# EAGLE design BurnBabyBurn (EAGLE 6.5.0)
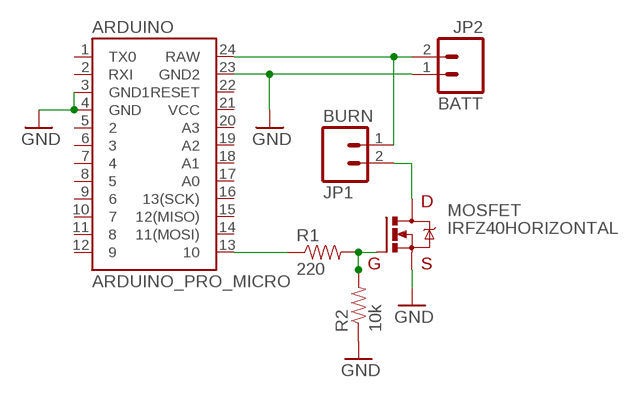
[diagram p0: schematic, sheet 1]

## Parts
ARDUINO  ARDUINO_PRO_MICRO  [ARDUINO_PRO_MICRO]
JP1  BURN  M023.5MM  [SCREWTERMINAL-3.5MM-2]
JP2  BATT  M023.5MM  [SCREWTERMINAL-3.5MM-2]
MOSFET  IRFZ40HORIZONTAL  [TO220]
R1  220  RESISTOREZ  [AXIAL-0.3EZ]
R2  10k  RESISTOREZ  [AXIAL-0.3EZ]

## Nets
GND: ARDUINO.3(GND1) ARDUINO.4(GND) ARDUINO.23(GND2) JP2.1 MOSFET.3(S) R2.P$1
N$1: MOSFET.1(G) R1.P$2 R2.P$2
N$2: JP1.2 MOSFET.2(D)
N$3: ARDUINO.13 R1.P$1
VBATT: ARDUINO.24(RAW) JP1.1 JP2.2
Unconnected: ARDUINO.1(TX0) ARDUINO.2(RXI) ARDUINO.5 ARDUINO.6 ARDUINO.7 ARDUINO.8 ARDUINO.9 ARDUINO.10 ARDUINO.11 ARDUINO.12 ARDUINO.14(11(MOSI)) ARDUINO.15(12(MISO)) ARDUINO.16(13(SCK)) ARDUINO.17(A0) ARDUINO.18(A1) ARDUINO.19(A2) ARDUINO.20(A3) ARDUINO.21(VCC) ARDUINO.22(RESET)

## Library data of the parts
ARDUINO = SparkFun-Boards:ARDUINO_PRO_MICRO
JP1 JP2 = SparkFun:M02: Header 2 Standard 2-pin 0.1" header. Use with straight break away headers (SKU : PRT-00116), right angle break away headers (PRT-00553), swiss pins (PRT-00743), machine pins (PRT-00117), and female headers (PRT-00115). Molex polarized connector foot print use with SKU : PRT-08233 with associated crimp pins and housings.
MOSFET = Johnboiles:IRFZ40: MOSFET: N-Channel; Vds 60V; Rds (Vgs=10V) .028; Id 50A (Vgs=10V)
R1 R2 = SparkFun-Resistors:RESISTOR: Resistor Basic schematic elements and footprints for 0603, 1206, and PTH resistors.

## Board
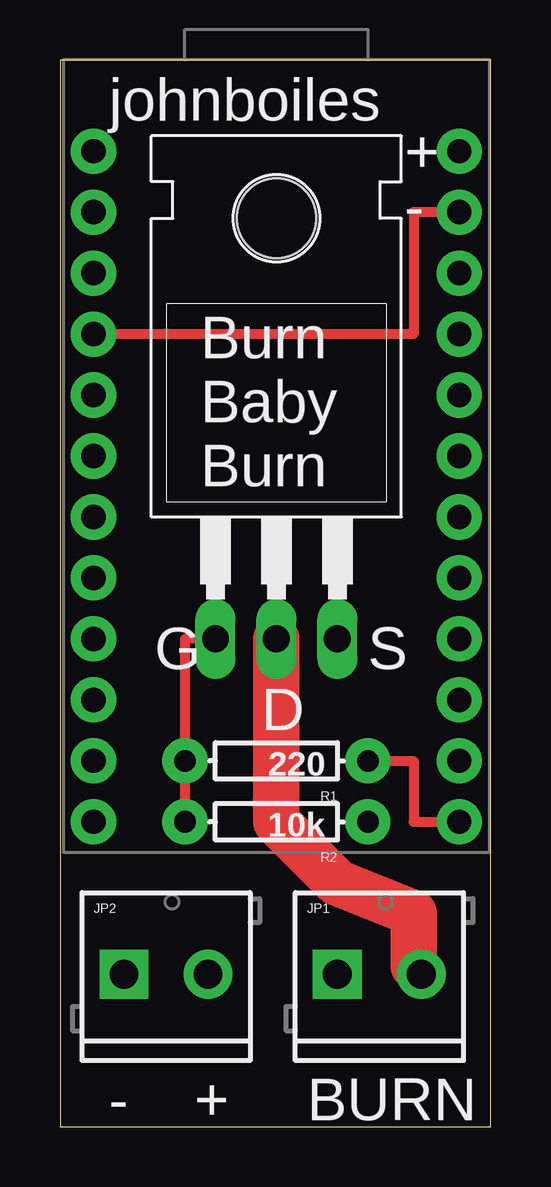
[diagram p1: board, top side]
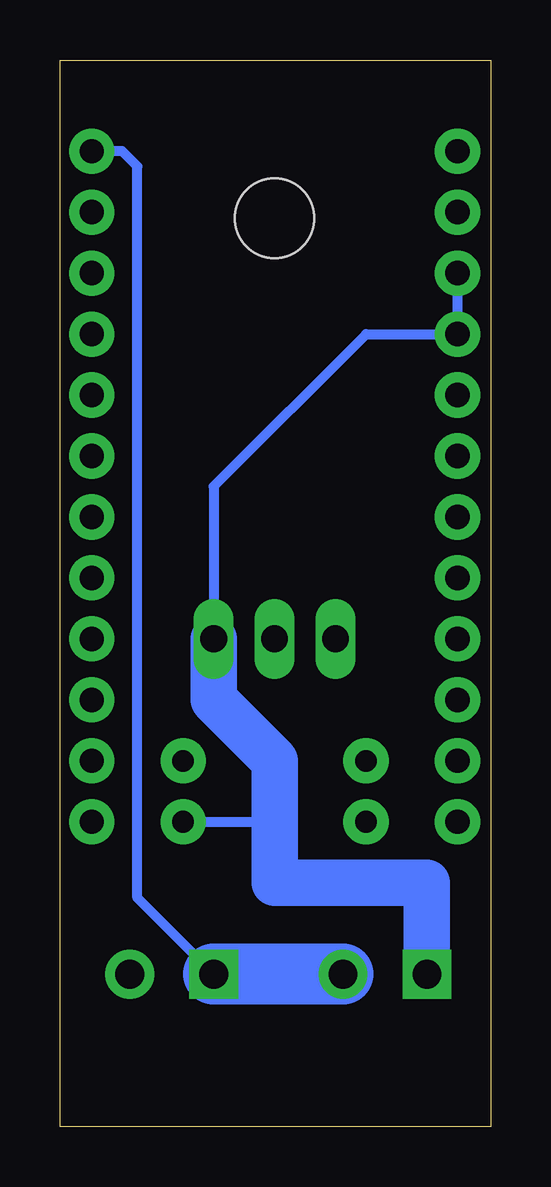
[diagram p2: board, bottom side, seen from below]

Size 17.96 x 44.44 mm. Coordinates in mm from the lower left corner, seen from the top.
Outline: 0,0 17.96,0 17.96,44.44 0,44.44 0,0
Copper layers (1*16): Top 0.0356mm / dielectric 1.5011mm / Bottom 0.0356mm
Design rules "LaenPCBOrder": minimum track width 6mil, minimum drill 13mil, track to track 6mil, track to pad 6mil, pad to pad 6mil, via to via 6mil, smd to smd 6mil, copper to edge 15mil, drill to drill 6mil, minimum pad ring 7mil, minimum via ring 7mil, stop-mask expansion 4mil, vias tented up to drill 0mil, thermal gap 10mil

### Footprints (pad centres in the part's own frame; a part is rotated, then mirrored left to right if it is on the bottom)
ARDUINO_PRO_MICRO = drill 1.016 pad 1.88: 1 -7.62,12.7; 2 -7.62,10.16; 3 -7.62,7.62; 4 -7.62,5.08; 5 -7.62,2.54; 6 -7.62,0; 7 -7.62,-2.54; 8 -7.62,-5.08; 9 -7.62,-7.62; 10 -7.62,-10.16; 11 -7.62,-12.7; 12 -7.62,-15.24; 13 7.62,-15.24; 14 7.62,-12.7; 15 7.62,-10.16; 16 7.62,-7.62; 17 7.62,-5.08; 18 7.62,-2.54; 19 7.62,0; 20 7.62,2.54; 21 7.62,5.08; 22 7.62,7.62; 23 7.62,10.16; 24 7.62,12.7
SCREWTERMINAL-3.5MM-2 = drill 1.2 pad 2.032 square: 1 0,0 | drill 1.2 pad 2.032: 2 3.5,0
TO220 = drill 1.118 long: 1 -2.54,-6.35; 2 0,-6.35; 3 2.54,-6.35 | hole 3.302: 0,11.176
AXIAL-0.3EZ = drill 0.9 pad 1.88: P$1 -3.81,0; P$2 3.81,0

### Placement (x,y rotation side)
ARDUINO  9.02,27.94 0 top
JP1  11.56,6.35 0 top
JP2  2.67,6.35 0 top
MOSFET  9.02,26.67 0 top
R1  9.02,15.24 180 top
R2  9.02,12.7 180 top

### Tracks (layer width: path | path; a pad name or v marks a point on that pad's centre or on a via)
GND
  Top 0.406: ARDUINO.23 14.73,38.1 14.73,33.02 ARDUINO.4
  Bottom 0.406: R2.P$1 9.02,12.7 | MOSFET.3 11.56,26.67 5.21,33.02 ARDUINO.4 ARDUINO.3
  Bottom 1.93: MOSFET.3 11.56,17.78 9.02,15.24 9.02,12.7 9.02,10.16 2.67,10.16 JP2.1
N$1
  Top 0.406: R2.P$2 R1.P$2 5.21,20.32 MOSFET.1
N$2
  Top 1.93: MOSFET.2 9.02,12.7 11.56,10.16 14.73,8.89 14.73,6.67 JP1.2
N$3
  Top 0.406: R1.P$1 14.73,15.24 14.73,12.7 ARDUINO.13
VBATT
  Bottom 0.406: JP1.1 14.73,9.53 14.73,40.01 15.37,40.64 ARDUINO.24
  Bottom 2.54: JP2.2 JP1.1

### Text on the board
tPlace: johnboiles | + | - | Burn / Baby / Burn | G | S | D | - | + | BURN